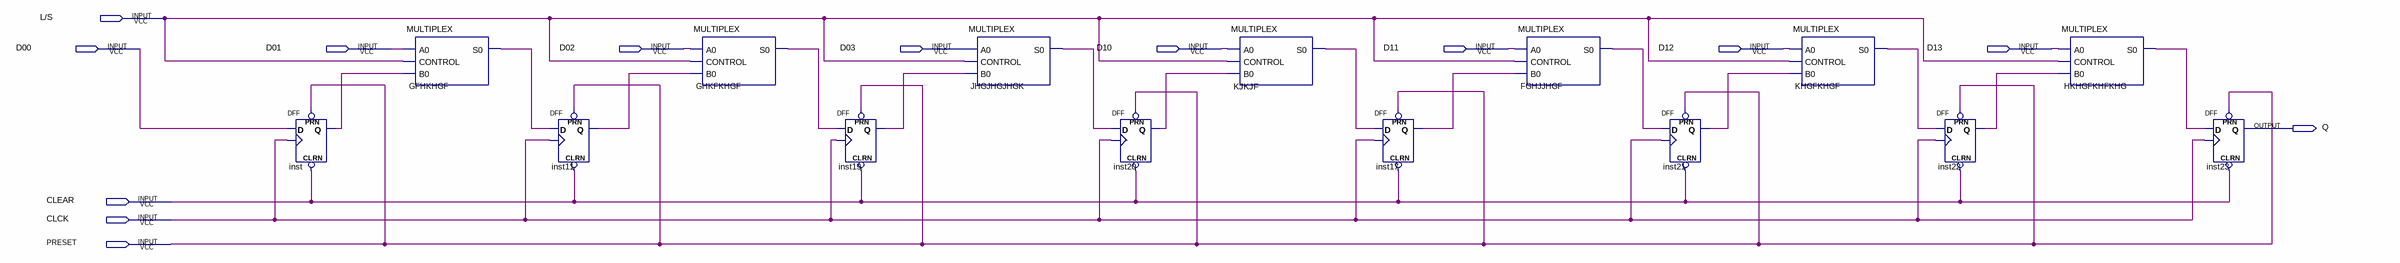
[diagram p0: schematic sheet]
// Quartus schematic PISO8BITS.bdf as structural Verilog: 15 symbols, 13 pins
module PISO8BITS (
  input  \L/S ,
  input  D00,
  input  D01,
  input  D02,
  input  D03,
  input  D10,
  input  D11,
  input  D12,
  input  D13,
  input  CLEAR,
  input  CLCK,
  input  PRESET,
  output Q
);

  wire FGHJJHGF_s0, GFHKHGF_s0, GHKFKHGF_s0, HKHGFKHFKHG_s0, inst11_q, inst17_q, inst19_q, inst20_q,
       inst21_q, inst22_q, inst_q, JHGJHGJHGK_s0, KHGFKHGF_s0, KJKJF_s0;

  DFF inst (.CLRN(CLEAR), .CLK(CLCK), .D(D00), .PRN(PRESET), .Q(inst_q));
  MULTIPLEX GFHKHGF (.A0(D01), .CONTROL(\L/S ), .B0(inst_q), .S0(GFHKHGF_s0));
  DFF inst11 (.CLRN(CLEAR), .CLK(CLCK), .D(GFHKHGF_s0), .PRN(PRESET), .Q(inst11_q));
  MULTIPLEX GHKFKHGF (.A0(D02), .CONTROL(\L/S ), .B0(inst11_q), .S0(GHKFKHGF_s0));
  DFF inst19 (.CLRN(CLEAR), .CLK(CLCK), .D(GHKFKHGF_s0), .PRN(PRESET), .Q(inst19_q));
  MULTIPLEX JHGJHGJHGK (.A0(D03), .CONTROL(\L/S ), .B0(inst19_q), .S0(JHGJHGJHGK_s0));
  DFF inst20 (.CLRN(CLEAR), .CLK(CLCK), .D(JHGJHGJHGK_s0), .PRN(PRESET), .Q(inst20_q));
  MULTIPLEX KJKJF (.A0(D10), .CONTROL(\L/S ), .B0(inst20_q), .S0(KJKJF_s0));
  DFF inst17 (.CLRN(CLEAR), .CLK(CLCK), .D(KJKJF_s0), .PRN(PRESET), .Q(inst17_q));
  MULTIPLEX FGHJJHGF (.A0(D11), .CONTROL(\L/S ), .B0(inst17_q), .S0(FGHJJHGF_s0));
  DFF inst21 (.CLRN(CLEAR), .CLK(CLCK), .D(FGHJJHGF_s0), .PRN(PRESET), .Q(inst21_q));
  MULTIPLEX KHGFKHGF (.A0(D12), .CONTROL(\L/S ), .B0(inst21_q), .S0(KHGFKHGF_s0));
  DFF inst22 (.CLRN(CLEAR), .CLK(CLCK), .D(KHGFKHGF_s0), .PRN(PRESET), .Q(inst22_q));
  MULTIPLEX HKHGFKHFKHG (.A0(D13), .CONTROL(\L/S ), .B0(inst22_q), .S0(HKHGFKHFKHG_s0));
  DFF inst23 (.CLRN(CLEAR), .CLK(CLCK), .D(HKHGFKHFKHG_s0), .PRN(PRESET), .Q(Q));
endmodule
